# EAGLE design PiCam_Switch_1.2 (EAGLE 8.0.0)
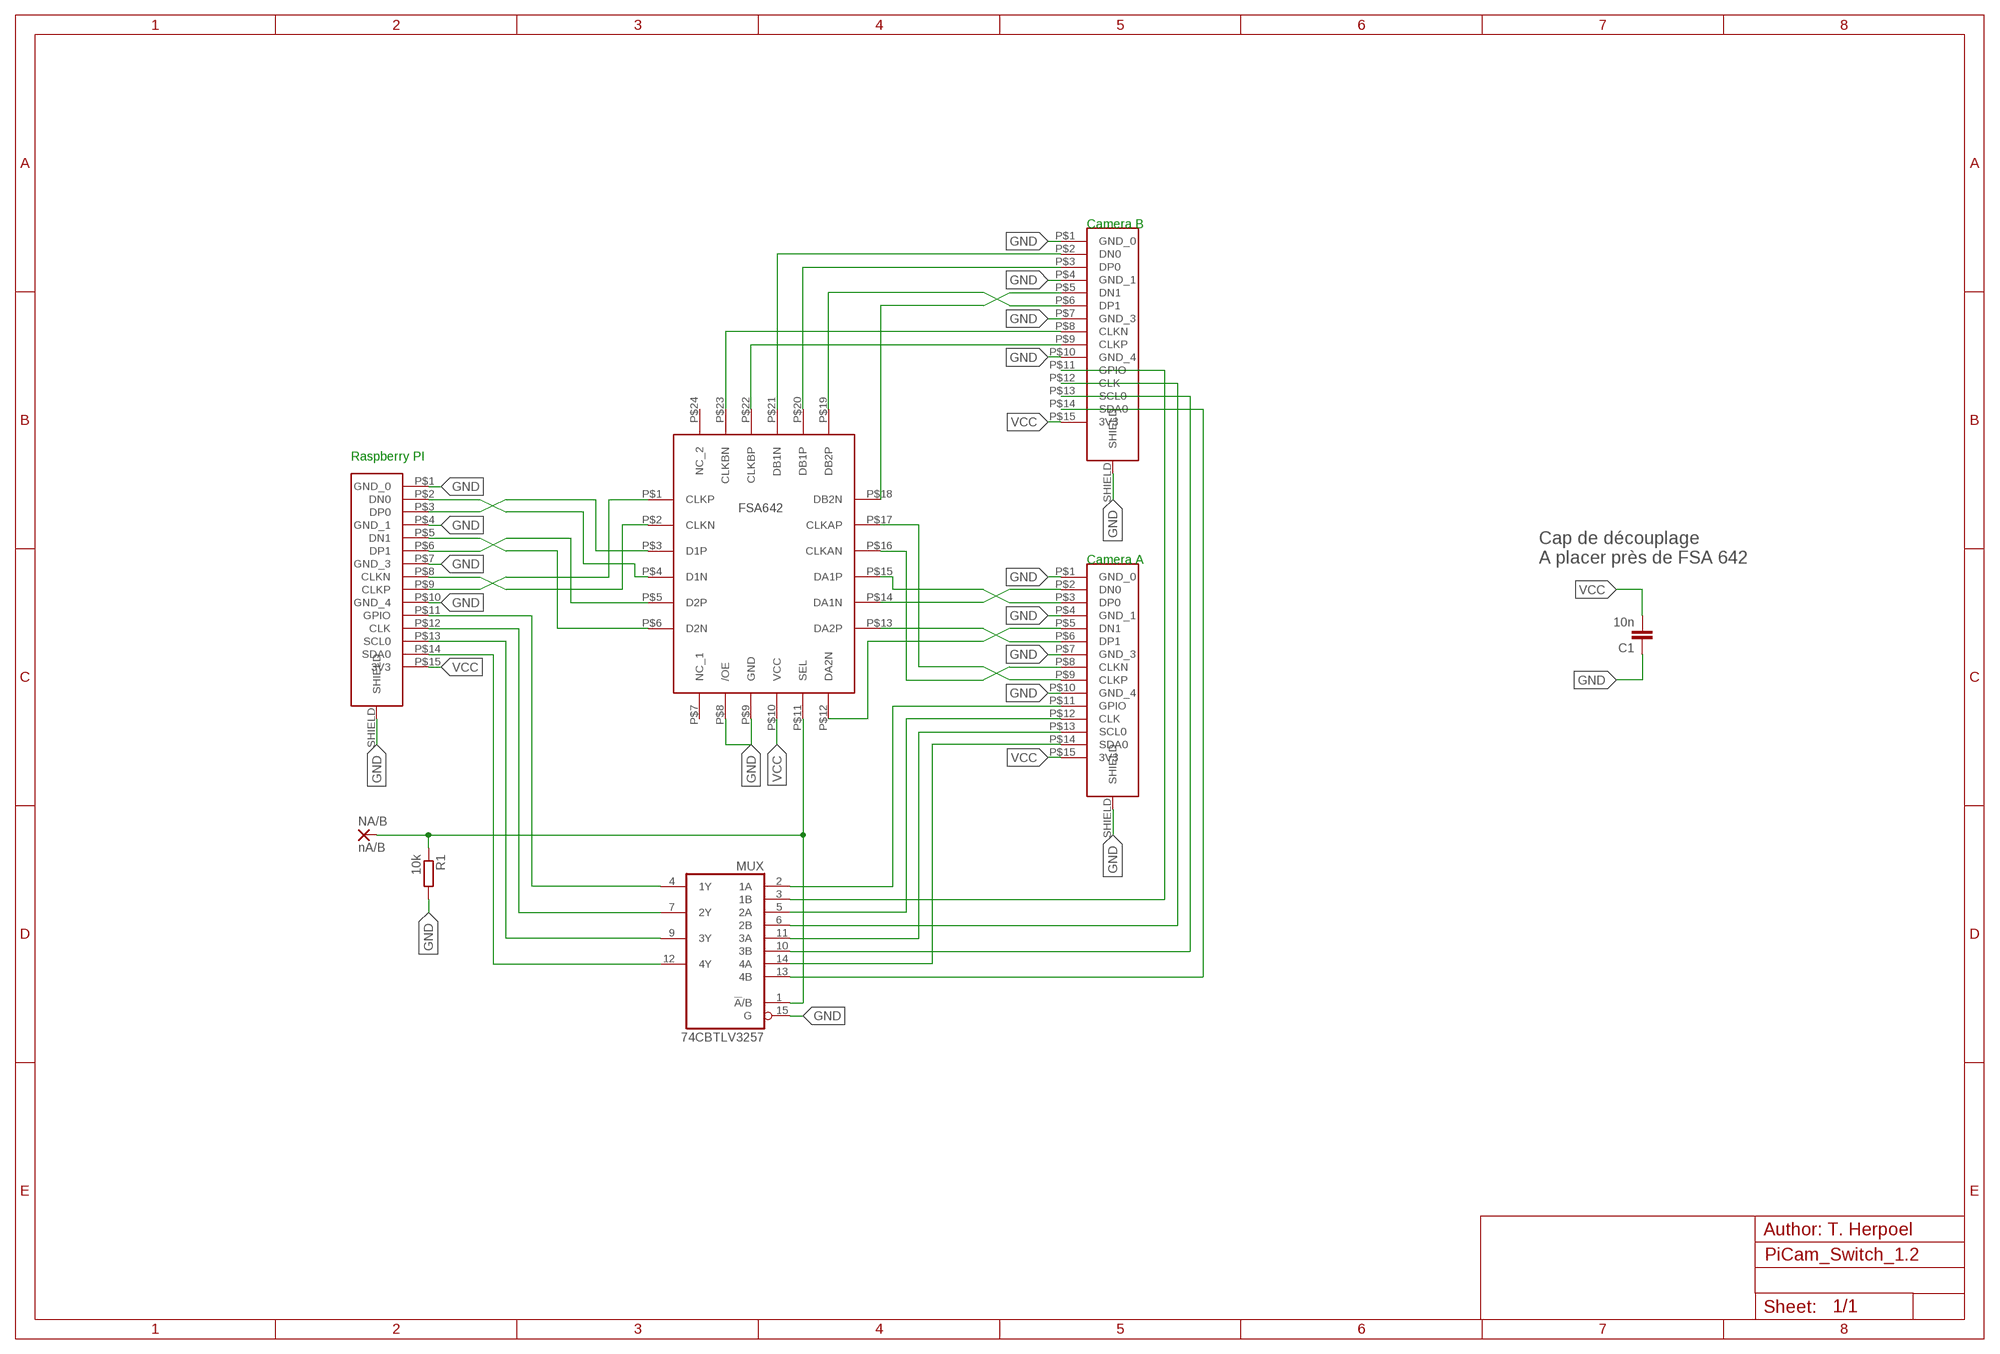
[diagram p0: schematic, sheet 1]

## Parts
C1  10n  C-EUC1206  [C1206]
CAM_A  PICAM  [FPC-CONN-15-SMD]
CAM_B  PICAM  [FPC-CONN-15-SMD]
MUX  74CBTLV3257  74HCT157D  [SO16]
NA/B  nA/B  SMD2  [SMD1,27-2,54]
R1  10k  R-EU_R1206  [R1206]
RPI  PICAM  [FPC-CONN-15-SMD]
U$1  FSA642  [UMLP-24]

## Nets
CLK_N [diff]: RPI.P$8(CLKN) U$1.P$2(CLKN)
CLK_P [diff]: RPI.P$9(CLKP) U$1.P$1(CLKP)
CLKA_N [diff]: CAM_A.P$8(CLKN) U$1.P$16(CLKAN)
CLKA_P [diff]: CAM_A.P$9(CLKP) U$1.P$17(CLKAP)
CLKB_N [diff]: CAM_B.P$8(CLKN) U$1.P$23(CLKBN)
CLKB_P [diff]: CAM_B.P$9(CLKP) U$1.P$22(CLKBP)
D0_N [diff]: RPI.P$2(DN0) U$1.P$4(D1N)
D0_P [diff]: RPI.P$3(DP0) U$1.P$3(D1P)
D1_N [diff]: RPI.P$5(DN1) U$1.P$6(D2N)
D1_P [diff]: RPI.P$6(DP1) U$1.P$5(D2P)
DA0_N [diff]: CAM_A.P$2(DN0) U$1.P$14(DA1N)
DA0_P [diff]: CAM_A.P$3(DP0) U$1.P$15(DA1P)
DA1_N [diff]: CAM_A.P$5(DN1) U$1.P$12(DA2N)
DA1_P [diff]: CAM_A.P$6(DP1) U$1.P$13(DA2P)
DB0_N [diff]: CAM_B.P$2(DN0) U$1.P$21(DB1N)
DB0_P [diff]: CAM_B.P$3(DP0) U$1.P$20(DB1P)
DB1_N [diff]: CAM_B.P$5(DN1) U$1.P$18(DB2N)
DB1_P [diff]: CAM_B.P$6(DP1) U$1.P$19(DB2P)
GND: C1.1 CAM_A.P$1(GND_0) CAM_A.P$4(GND_1) CAM_A.P$7(GND_3) CAM_A.P$10(GND_4) CAM_A.SHIELD CAM_B.P$1(GND_0) CAM_B.P$4(GND_1) CAM_B.P$7(GND_3) CAM_B.P$10(GND_4) CAM_B.SHIELD MUX.15(G) R1.2 RPI.P$1(GND_0) RPI.P$4(GND_1) RPI.P$7(GND_3) RPI.P$10(GND_4) RPI.SHIELD U$1.P$8(/OE) U$1.P$9(GND)
N$3: MUX.1(!A!/B) NA/B.1(P) R1.1 U$1.P$11(SEL)
N$4: MUX.4(1Y) RPI.P$11(GPIO)
N$5: MUX.7(2Y) RPI.P$12(CLK)
N$6: MUX.9(3Y) RPI.P$13(SCL0)
N$7: MUX.12(4Y) RPI.P$14(SDA0)
N$8: CAM_A.P$11(GPIO) MUX.2(1A)
N$9: CAM_A.P$12(CLK) MUX.5(2A)
N$10: CAM_A.P$13(SCL0) MUX.11(3A)
N$11: CAM_A.P$14(SDA0) MUX.14(4A)
N$12: CAM_B.P$11(GPIO) MUX.3(1B)
N$13: CAM_B.P$12(CLK) MUX.6(2B)
N$14: CAM_B.P$13(SCL0) MUX.10(3B)
N$15: CAM_B.P$14(SDA0) MUX.13(4B)
VCC: C1.2 CAM_A.P$15(3V3) CAM_B.P$15(3V3) RPI.P$15(3V3) U$1.P$10(VCC)
Unconnected: U$1.P$7(NC_1) U$1.P$24(NC_2)

## Notes on the sheet
- Camera B
- Raspberry PI
- FSA642
- Camera A
- Cap de découplage
  A placer près de FSA 642

## Power pins joined to a net without a drawn wire
GND: MUX.8(GND)
VCC: MUX.16(VCC)

## Library data of the parts
C1 = rcl:C-EU: CAPACITOR, European symbol
CAM_A CAM_B RPI = personal:PICAM
MUX = 74xx-eu:74*157: Quadruple 2-line to 1-line data SELECTOR/MULTIPLEXER
NA/B = wirepad:SMD2: SMD PAD
R1 = resistor:R-EU_: RESISTOR, European symbol
U$1 = personal:FSA642

## Net classes
0 default: width 0.203 mm
1 diff: width 0.152 mm, drill 0.33 mm, clearance 0.152 mm

## Board
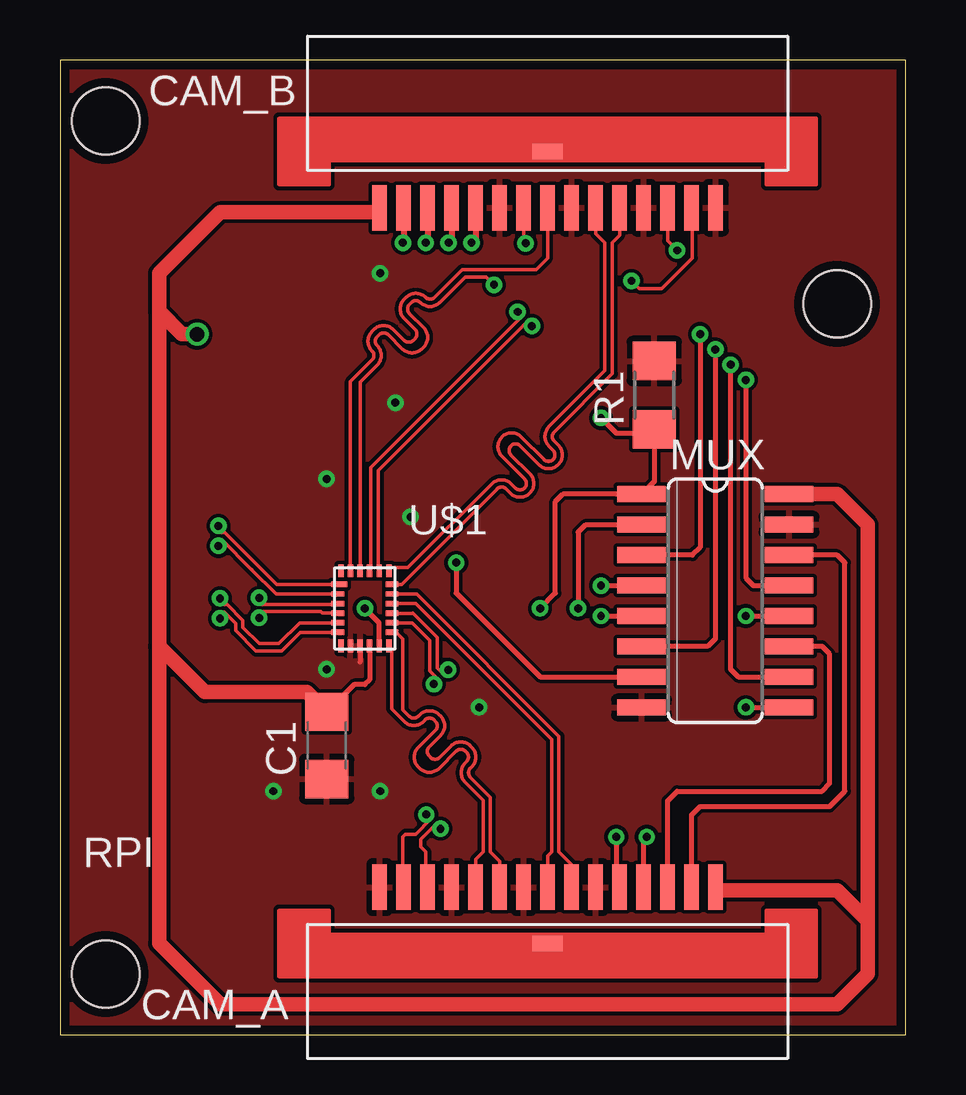
[diagram p1: board, top side]
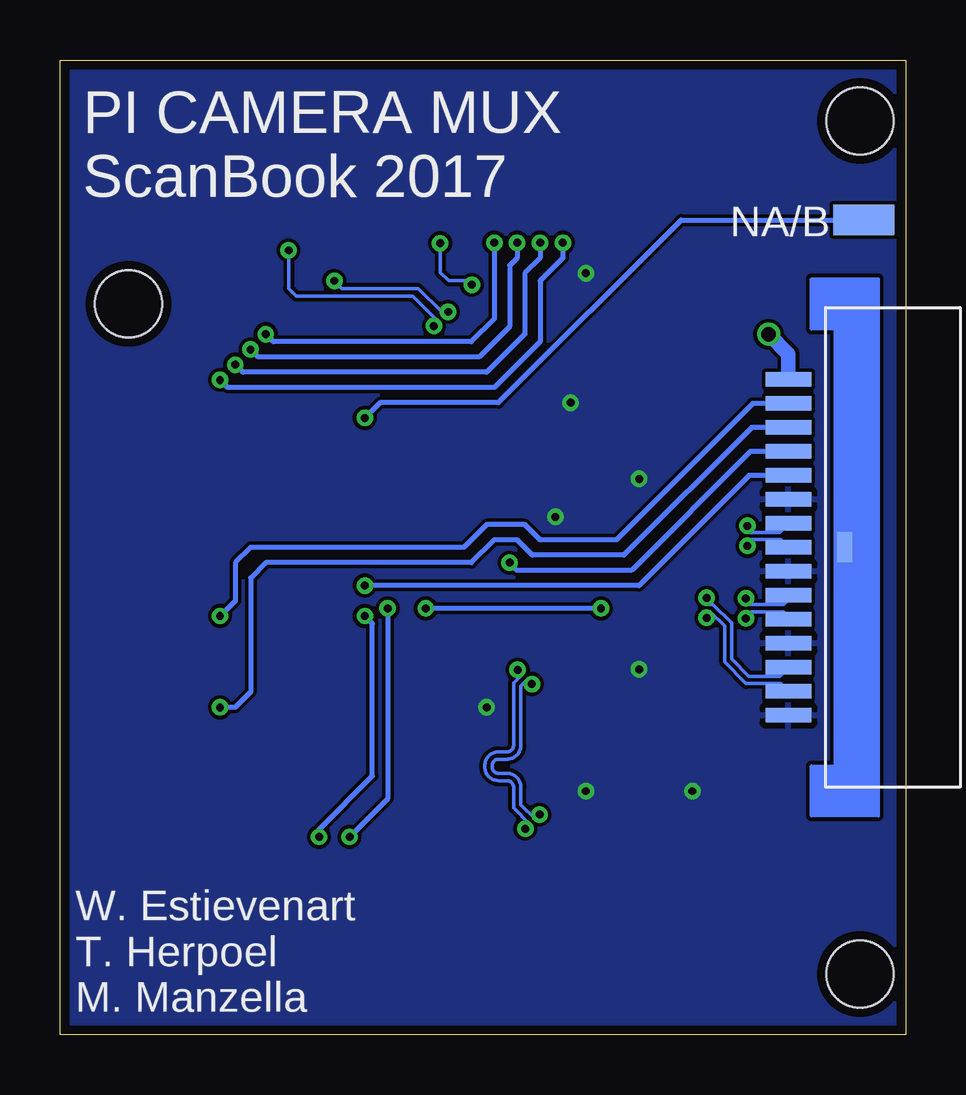
[diagram p2: board, bottom side, seen from below]

Size 35.24 x 40.64 mm. Coordinates in mm from the lower left corner, seen from the top.
Outline: 0,0 35.24,0 35.24,40.64 0,40.64 0,0
Copper layers (1*16): Top 0.0356mm / dielectric 1.5011mm / Bottom 0.0356mm
Design rules "oshpark-2layer": minimum track width 6mil, minimum drill 13mil, track to track 6mil, track to pad 6mil, pad to pad 6mil, via to via 6mil, smd to smd 6mil, copper to edge 15mil, drill to drill 6mil, minimum pad ring 7mil, minimum via ring 7mil, stop-mask expansion 2.5mil, vias tented up to drill 0mil, thermal gap 10mil
Holes 2.8 mm at 1.91,2.54 1.91,38.1 32.38,30.48

### Footprints (pad centres in the part's own frame; a part is rotated, then mirrored left to right if it is on the bottom)
C1206 = smd 1.6 x 1.8: 1 -1.4,0; 2 1.4,0
FPC-CONN-15-SMD = smd 0.6 x 1.9: P$1 -7,2.35; P$2 -6,2.35; P$3 -5,2.35; P$4 -4,2.35; P$5 -3,2.35; P$6 -2,2.35; P$7 -1,2.35; P$8 0,2.35; P$9 1,2.35; P$10 2,2.35; P$11 3,2.35; P$12 4,2.35; P$13 5,2.35; P$14 6,2.35; P$15 7,2.35 | smd 1.27 x 0.635: SHIELD 0,0
SO16 = smd 0.66 x 2.032: 1 -4.445,-3.073; 2 -3.175,-3.073; 3 -1.905,-3.073; 4 -0.635,-3.073; 5 0.635,-3.073; 6 1.905,-3.073; 7 3.175,-3.073; 8 4.445,-3.073; 9 4.445,3.073; 10 3.175,3.073; 11 1.905,3.073; 12 0.635,3.073; 13 -0.635,3.073; 14 -1.905,3.073; 15 -3.175,3.073; 16 -4.445,3.073
SMD1,27-2,54 = smd 1.27 x 2.54: 1 0,0
R1206 = smd 1.6 x 1.803: 1 -1.422,0; 2 1.422,0
UMLP-24 = smd 0.663 x 0.225: P$1 -1.069,1 | smd 0.535 x 0.225: P$2 -1.133,0.6; P$3 -1.133,0.2; P$4 -1.133,-0.2; P$5 -1.133,-0.6; P$6 -1.133,-1; P$13 1.133,-1; P$14 1.133,-0.6; P$15 1.133,-0.2; P$16 1.133,0.2; P$17 1.133,0.6; P$18 1.133,1 | smd 0.225 x 0.535: P$7 -1,-1.568; P$8 -0.6,-1.569; P$9 -0.2,-1.569; P$10 0.2,-1.569; P$11 0.6,-1.569; P$12 1,-1.569; P$19 1,1.568; P$20 0.6,1.568; P$21 0.2,1.568; P$22 -0.2,1.568; P$23 -0.6,1.568; P$24 -1,1.568

### Placement (x,y rotation side)
C1  11.11,12.06 90 top
CAM_A  20.32,3.81 0 top
CAM_B  20.32,36.83 180 top
MUX  27.3,18.1 270 top
NA/B  1.75,33.97 90 bottom
R1  24.77,26.67 90 top
RPI  2.54,20.32 90 bottom
U$1  12.7,17.78 0 top

### Tracks (layer width: path | path; a pad name or v marks a point on that pad's centre or on a via)
CLK_N  (via drill 0.33)
  Top 0.152: v6.6,20.38 6.6,20.65 6.74,20.65 7.98,19.41 | 7.98,19.41 7.99,19.39 | 7.98,19.41 9,18.38 U$1.P$2
  Bottom 0.152: RPI.P$8 5.22,20.65 6.6,20.65 v6.6,20.38
CLK_P  (via drill 0.33)
  Top 0.152: v6.6,21.22 6.6,20.95 6.86,20.95 9.04,18.78 U$1.P$1
  Bottom 0.152: RPI.P$9 5.26,20.95 6.6,20.95 v6.6,21.22
CLKA_N
  Top 0.152: CAM_A.P$8 20.32,7.46 20.48,7.62 20.48,12.32 14.82,17.98 U$1.P$16
CLKA_P
  Top 0.152: CAM_A.P$9 21.32,7.09 20.79,7.62 20.79,12.45 14.86,18.38 14.01,18.38 13.97,18.41 13.87,18.41 U$1.P$17
CLKB_N
  Top 0.152: U$1.P$23 12.1,27.24 13,28.14 arc90 13,28.52 arc-90 13,29.32 13.08,29.4 arc-90 13.89,29.4 14.34,28.95 arc90 14.71,28.95 14.79,29.03 arc90 14.79,29.41 14.34,29.86 arc-90 14.34,30.67 14.42,30.75 arc-90 15.23,30.75 arc90 15.61,30.75 16.76,31.9 19.84,31.9 20.32,32.38 CAM_B.P$8
CLKB_P  (via drill 0.33)
  Top 0.152: U$1.P$22 12.5,27.21 13.21,27.92 arc90 13.21,28.73 arc-90 13.21,29.11 13.29,29.19 arc-90 13.67,29.19 14.26,28.59 arc90 15.07,28.59 15.15,28.67 arc90 15.15,29.48 14.56,30.07 arc-90 14.56,30.45 14.64,30.53 arc-90 15.02,30.53 arc90 15.82,30.53 16.89,31.6 17.75,31.6 v18.09,31.27 | CAM_B.P$9 19.32,33.08 v19.4,33
  Bottom 0.152: 19.36,32.95 v19.4,33 19.4,31.78 19.05,31.43 18.25,31.43 v18.09,31.27
D0_N  (via drill 0.33)
  Top 0.152: v8.3,17.38 8.3,17.65 10.87,17.65 10.93,17.58 U$1.P$4
  Bottom 0.152: RPI.P$2 5.22,14.65 6.66,14.65 7.55,15.54 7.55,17.04 8.16,17.65 8.3,17.65 v8.3,17.38
D0_P  (via drill 0.33)
  Top 0.152: v8.3,18.22 8.3,17.95 11.54,17.95 U$1.P$3
  Bottom 0.152: RPI.P$3 5.26,14.95 6.54,14.95 7.25,15.66 7.25,17.16 8.04,17.95 8.3,17.95 v8.3,18.22
D1_N  (via drill 0.33)
  Top 0.152: v6.67,17.36 6.67,17.63 6.85,17.63 7.32,17.16 7.32,16.85 8.17,16 9.23,16 10.01,16.78 U$1.P$6
  Bottom 0.152: RPI.P$5 4.89,17.44 5.08,17.63 6.67,17.63 v6.67,17.36
D1_P  (via drill 0.33)
  Top 0.152: v6.67,18.2 6.67,17.93 6.97,17.93 7.62,17.28 7.62,16.98 8.29,16.31 9.11,16.31 9.98,17.18 U$1.P$5
  Bottom 0.152: RPI.P$6 4.89,18.12 5.08,17.93 6.67,17.93 v6.67,18.2
DA0_N  (via drill 0.33)
  Top 0.152: v15.58,14.63 15.77,14.81 15.4,15.18 15.4,16.45 14.67,17.18 U$1.P$14 | v15.26,9.19 15.45,9 14.81,8.36 14.39,8.36 14.29,8.26 14.29,6.19 CAM_A.P$2
  Bottom 0.152: v15.58,14.63 15.77,14.81 16.04,14.54 16.04,12.06 arc90 16.61,11.49 16.97,11.49 arc-90 17.24,11.23 17.24,11.17 arc-90 16.97,10.9 16.61,10.9 arc90 16.04,10.33 16.04,9.59 15.45,9 v15.26,9.19
DA0_P  (via drill 0.33)
  Top 0.152: v16.17,15.22 15.98,15.03 15.71,15.3 15.71,16.57 14.71,17.57 | 14.71,17.57 14.7,17.58 | v15.85,8.59 15.66,8.78 15.03,8.15 15.03,7.83 15.24,7.62 15.24,6.24 CAM_A.P$3 | 14.71,17.57 13.84,17.57 U$1.P$15
  Bottom 0.152: v16.17,15.22 15.98,15.03 16.34,14.67 16.34,12.06 arc90 16.61,11.8 16.97,11.8 arc-90 17.54,11.23 17.54,11.17 arc-90 16.97,10.6 16.61,10.6 arc90 16.34,10.33 16.34,9.46 15.66,8.78 v15.85,8.59
DA1_N
  Top 0.152: U$1.P$12 13.82,16.09 13.82,13.59 14.34,13.07 arc90 15.15,13.07 15.21,13.13 arc-90 15.59,13.13 15.64,13.07 arc-90 15.64,12.7 14.93,11.98 arc90 14.93,11.17 14.98,11.11 arc90 15.79,11.11 16.51,11.83 arc-90 16.89,11.83 16.95,11.77 arc-90 16.95,11.39 16.88,11.33 arc90 16.88,10.52 17.63,9.78 17.63,7.62 17.32,7.31 CAM_A.P$5
DA1_P
  Top 0.152: CAM_A.P$6 18.32,7.23 17.93,7.62 17.93,9.91 17.1,10.74 arc-90 17.1,11.12 17.16,11.18 arc90 17.16,11.99 17.1,12.04 arc90 16.29,12.04 15.82,11.57 arc-90 15.44,11.57 15.38,11.62 arc-90 15.38,12 15.86,12.48 arc90 15.86,13.29 15.8,13.35 arc90 14.99,13.35 14.93,13.28 arc-90 14.55,13.28 14.29,13.55 14.29,16.51 14.02,16.78 U$1.P$13
DB0_N  (via drill 0.33)
  Top 0.152: U$1.P$21 12.95,19.4 12.95,23.65 19.26,29.95 v19.07,30.14 | v23.81,31.43 24.13,31.11 25.08,31.11 26.35,32.38 26.35,34.45 CAM_B.P$2
  Bottom 0.152: 19.26,29.95 v19.07,30.14 19.35,30.14 20.32,31.11 23.5,31.11 v23.81,31.43
DB0_P  (via drill 0.33)
  Top 0.152: U$1.P$20 13.26,19.39 13.26,23.52 19.48,29.74 v19.66,29.55 | CAM_B.P$3 25.32,33.1 v25.72,32.7
  Bottom 0.152: v25.72,32.7 25.72,31.11 25.4,30.8 20.54,30.8 19.48,29.74 v19.66,29.55
DB1_N
  Top 0.152: CAM_B.P$5 23.32,33.33 23.01,33.02 23.01,27.56 20.59,25.13 arc90 20.59,24.76 20.76,24.58 arc-90 20.76,23.77 20.76,23.77 arc-90 19.95,23.77 19.17,24.55 arc90 18.79,24.55 18.79,24.55 arc90 18.79,24.18 19.57,23.39 arc-90 19.57,22.58 19.57,22.58 arc-90 18.76,22.58 18.59,22.76 arc90 18.21,22.76 14.23,18.78 14.02,18.78 13.97,18.73 13.88,18.73 U$1.P$18
DB1_P
  Top 0.152: U$1.P$19 13.83,19.48 14.5,19.48 17.99,22.97 arc-90 18.8,22.97 18.98,22.8 arc90 19.36,22.8 19.36,22.8 arc90 19.36,23.18 18.41,24.12 arc-90 18.41,24.93 18.42,24.93 arc-90 19.22,24.93 20.17,23.99 arc90 20.54,23.99 20.55,23.99 arc90 20.55,24.37 20.37,24.54 arc-90 20.37,25.35 22.71,27.69 22.71,33.02 22.32,33.41 CAM_B.P$6
GND  (via drill 0.33)
  Top 0.203: U$1.P$9 12.5,15.54
  other vias: 13.34,31.75 8.89,10.16 11.11,23.18 13.97,26.35 14.61,21.59 17.46,13.65 13.34,10.16 11.11,15.24
  pour Top: 0,40.64 35.24,40.64 35.24,0 0,0
  pour Bottom: 0,40.64 35.24,40.64 35.24,0 0,0
N$3  (via drill 0.33)
  Top 0.203: U$1.P$11 13.3,17.18 v12.7,17.78 | v20,17.78 20.64,18.41 20.64,22.23 20.95,22.54 MUX.1 | MUX.1 23.18,22.54 | MUX.1 24.77,23.08 R1.1 24.6,25.08 23.18,25.08 v22.54,25.72
  Bottom 0.203: v12.7,17.78 v20,17.78 | v22.54,25.72 21.91,26.35 16.98,26.35 9.36,33.97 NA/B.1
N$4  (via drill 0.33)
  Top 0.203: v22.54,18.73 MUX.4
  Bottom 0.203: RPI.P$11 6.53,23.32 11.11,18.73 v22.54,18.73
N$5  (via drill 0.33)
  Top 0.203: v16.51,19.68 16.51,18.41 20,14.92 MUX.7
  Bottom 0.203: RPI.P$12 6.48,24.32 11.43,19.37 16.19,19.37 v16.51,19.68
N$6  (via drill 0.33)
  Top 0.203: v28.57,13.65 MUX.9
  Bottom 0.203: RPI.P$13 6.43,25.32 11.75,20 15.56,20 16.19,20.64 17.14,20.64 18.1,19.68 26.67,19.68 27.3,19.05 27.3,14.29 27.94,13.65 v28.57,13.65
N$7  (via drill 0.33)
  Top 0.203: v28.57,17.46 MUX.12
  Bottom 0.203: RPI.P$14 6.38,26.32 12.06,20.64 15.24,20.64 15.88,21.27 17.46,21.27 18.41,20.32 27.3,20.32 27.94,19.68 27.94,18.1 v28.57,17.46
N$8  (via drill 0.33)
  Top 0.203: v21.59,17.78 21.59,20.95 21.91,21.27 MUX.2 | v23.18,8.26 23.18,6.3 CAM_A.P$11
  Bottom 0.203: v21.59,17.78 21.59,9.84 v23.18,8.26
N$9  (via drill 0.33)
  Top 0.203: CAM_A.P$12 24.32,8.13 v24.45,8.26 | v22.54,17.46 MUX.5
  Bottom 0.203: v24.45,8.26 24.45,8.57 22.23,10.79 22.23,17.14 v22.54,17.46
N$10
  Top 0.203: CAM_A.P$13 25.32,9.76 25.72,10.16 31.75,10.16 32.07,10.48 32.07,15.88 31.75,16.19 MUX.11
N$11
  Top 0.203: CAM_A.P$14 26.32,9.18 26.67,9.53 32.07,9.53 32.7,10.16 32.7,19.68 32.38,20 MUX.14
N$12  (via drill 0.33)
  Top 0.203: MUX.3 26.35,20 26.67,20.32 v26.67,29.21
  Top 0.254: CAM_B.P$11 17.32,33.2 v17.14,33.02
  Bottom 0.203: v26.67,29.21 26.35,28.89 18.1,28.89 17.14,29.84 v17.14,33.02
N$13  (via drill 0.33)
  Top 0.203: MUX.6 26.99,16.19 27.3,16.51 v27.3,28.57
  Top 0.254: CAM_B.P$12 16.32,33.15 v16.19,33.02
  Bottom 0.203: v27.3,28.57 26.99,28.26 17.78,28.26 16.51,29.53 16.51,32.07 16.19,32.38 v16.19,33.02
N$14  (via drill 0.33)
  Top 0.203: MUX.10 28.26,14.92 27.94,15.24 v27.94,27.94
  Top 0.254: CAM_B.P$13 15.32,33.1 v15.24,33.02
  Bottom 0.203: v27.94,27.94 27.62,27.62 17.46,27.62 15.88,29.21 15.88,31.75 15.24,32.38 v15.24,33.02
N$15  (via drill 0.33)
  Top 0.203: v28.57,27.3 28.57,19.05 28.89,18.73 MUX.13
  Top 0.254: CAM_B.P$14 14.32,33.05 v14.29,33.02
  Bottom 0.203: v28.57,27.3 28.26,26.99 17.14,26.99 15.24,28.89 15.24,31.43 14.29,32.38 v14.29,33.02
VCC  (via drill 0.61)
  Top 0.203: U$1.P$10 12.9,14.8 12.7,14.61 12.25,14.61 C1.2 | CAM_A.P$15 27.45,6.03
  Top 0.61: CAM_B.P$15 13.13,34.29 6.67,34.29 4.13,31.75 4.13,30.16 | 4.13,16.19 6.03,14.29 10.29,14.29 C1.2 | 4.13,16.19 4.13,3.81 6.67,1.27 32.38,1.27 33.66,2.54 33.66,4.76 | 27.45,6.03 32.38,6.03 33.66,4.76 | 33.66,4.76 33.66,21.27 32.38,22.54 MUX.16 | 4.13,30.16 4.13,16.19 | v5.71,29.21 5.08,29.21 4.13,30.16
  Bottom 0.61: v5.71,29.21 4.89,28.39 RPI.P$15

### Text on the board
bNames: PI CAMERA MUX / ScanBook 2017 | W. Estievenart / T. Herpoel / M. Manzella